# EAGLE design mosquino-pwr-peltier (EAGLE 5.08)
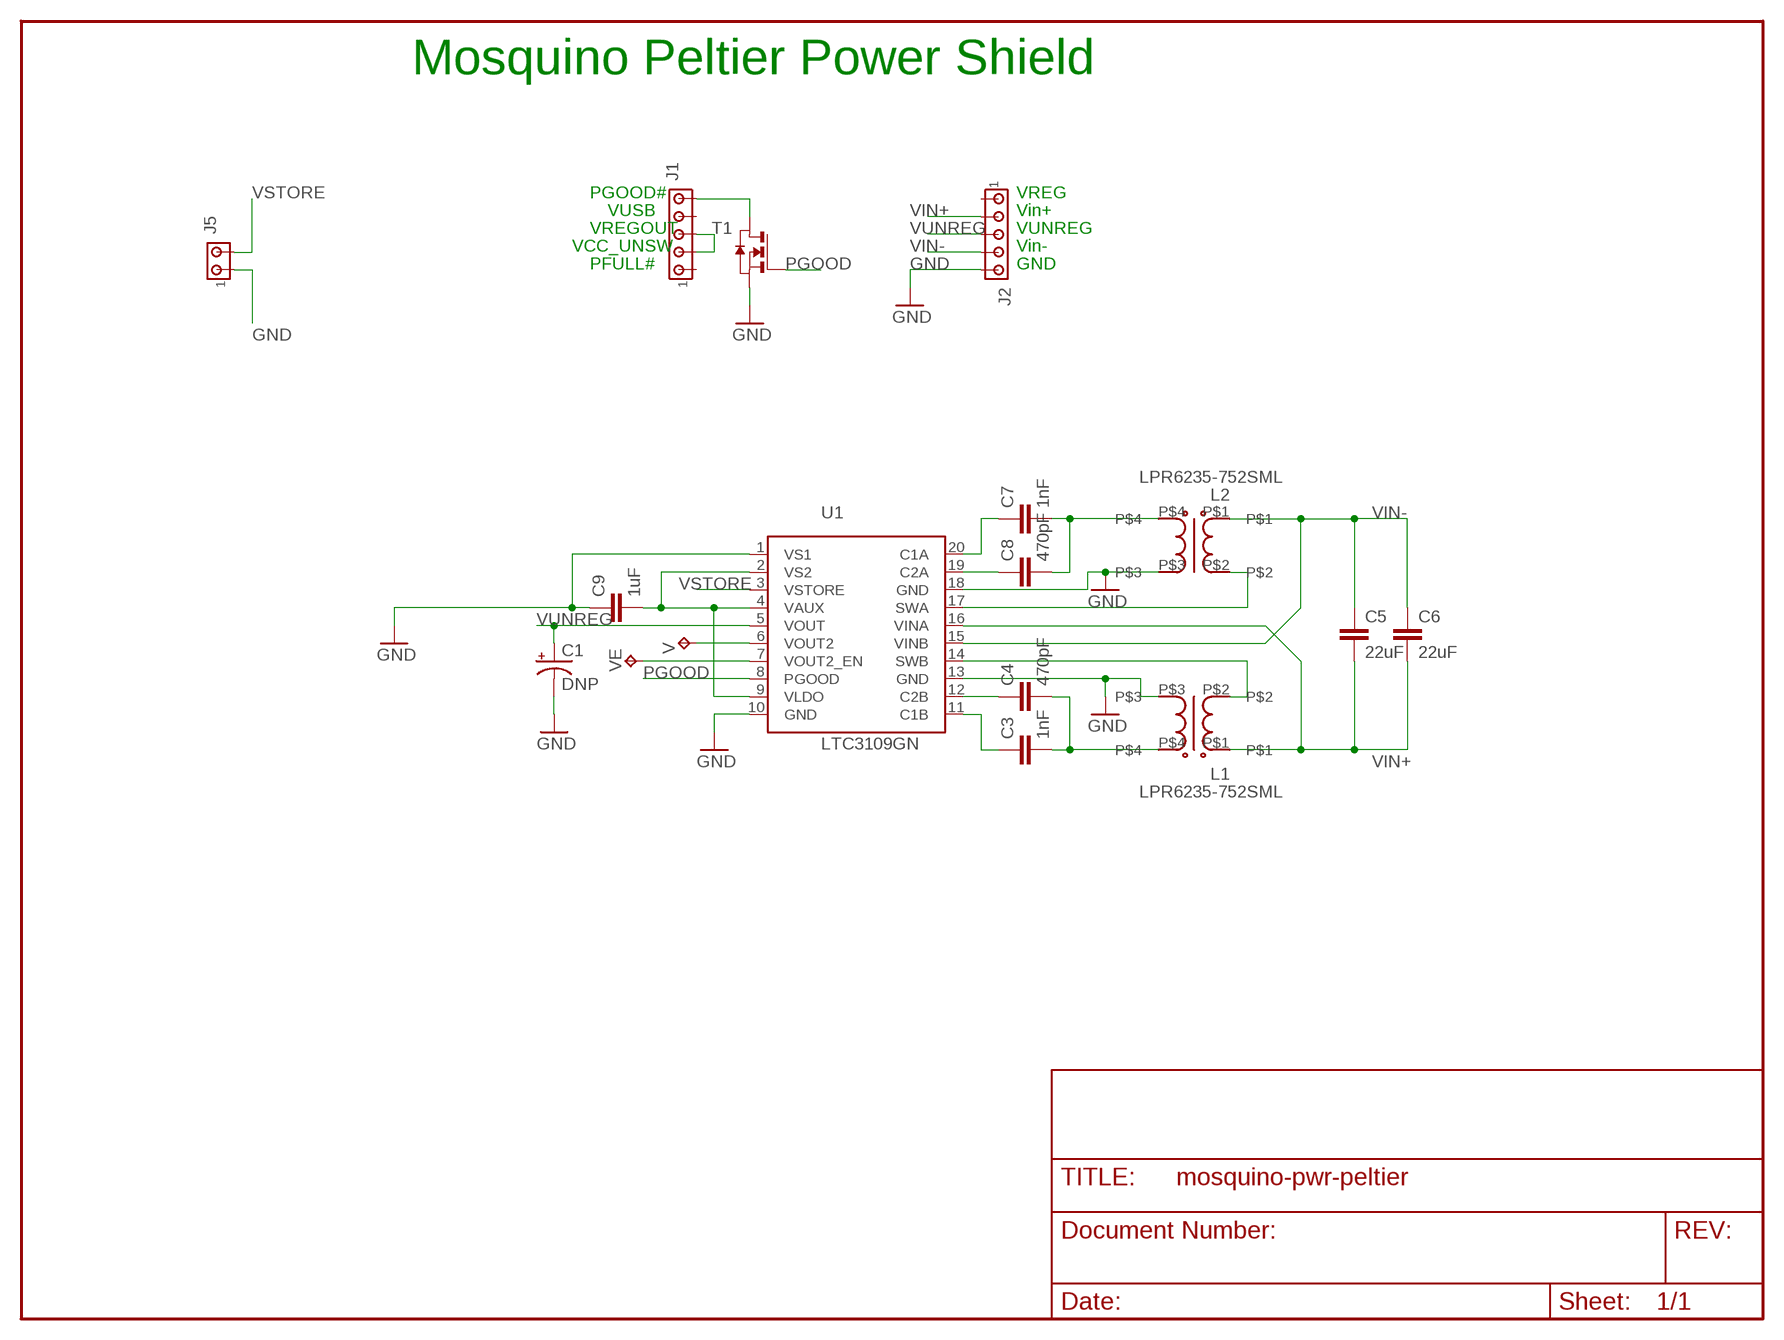
[diagram p0: schematic, sheet 1]

## Parts
C1  DNP  CPOL-USD  [PANASONIC_D]
C3  1nF  C-EUC0603  [C0603]
C4  470pF  C-EUC0603  [C0603]
C5  22uF  C-EUC0805  [C0805]
C6  22uF  C-EUC0805  [C0805]
C7  1nF  C-EUC0603  [C0603]
C8  470pF  C-EUC0603  [C0603]
C9  1uF  C-EUC0603  [C0603]
J1  MTA05-100  [10X05MTA]
J2  MTA05-100  [10X05MTA]
J5  MTA02-100  [10X02MTA]
L1  LPR6235-752SML  LPR6235_COIL  [LPR6235_COIL]
L2  LPR6235-752SML  LPR6235_COIL  [LPR6235_COIL]
T1  NMOSSOT23  [SOT-23]
U1  LTC3109GN  [SSOP20N]
V  TPTP09R  [TP09R]
VE  TPTP09R  [TP09R]

## Nets
GND [pwr]: C1.- C9.1 J2.5 J5.1 L1.P$3 L2.P$3 T1.2(S) U1.1(VS1) U1.10(GND) U1.13(GND) U1.18(GND)
N$1: U1.6(VOUT2) V.TP
N$2: U1.7(VOUT2_EN) VE.TP
N$3: C4.1 U1.12(C2B)
N$4: C3.1 U1.11(C1B)
N$5: C3.2 C4.2 L1.P$4
N$6: J1.5 T1.1(D)
N$7: C7.1 U1.20(C1A)
N$8: C8.1 U1.19(C2A)
N$9: C7.2 C8.2 L2.P$4
N$10: C9.2 U1.2(VS2) U1.4(VAUX) U1.9(VLDO)
N$16: J1.2 J1.3
PGOOD: T1.3(G) U1.8(PGOOD)
SWA: L2.P$2 U1.17(SWA)
SWB: L1.P$2 U1.14(SWB)
VIN+: C5.2 C6.2 J2.2 L1.P$1 U1.16(VINA)
VIN-: C5.1 C6.1 J2.4 L2.P$1 U1.15(VINB)
VSTORE [pwr]: J5.2 U1.3(VSTORE)
VUNREG: C1.+ J2.3 U1.5(VOUT)
Unconnected: J1.1 J1.4 J2.1

## Notes on the sheet
- Mosquino Peltier Power Shield
- PGOOD# | VREG
- VUSB | Vin+
- VREGOUT | VUNREG
- VCC_UNSW | Vin-
- PFULL# | GND

## Library data of the parts
C1 = rcl:CPOL-US: POLARIZED CAPACITOR, American symbol
C3-C9 = rcl:C-EU: CAPACITOR, European symbol
J1 J2 = con-amp:MTA05-100: AMP connector
J5 = con-amp:MTA02-100: AMP connector
L1 L2 = tim:LPR6235_COIL: Coilcraft LPR6235 SMD inductor/transformer. 20100815 / tgipson
T1 = zetex:NMOSSOT23: MOS FET
U1 = tim:LTC3109
V VE = testpad:TP

## Net classes
1 pwr: width 0.305 mm, drill 0.508 mm, clearance 0.203 mm
4 digital: width 0.203 mm, drill 0.381 mm, clearance 0.203 mm

## Board
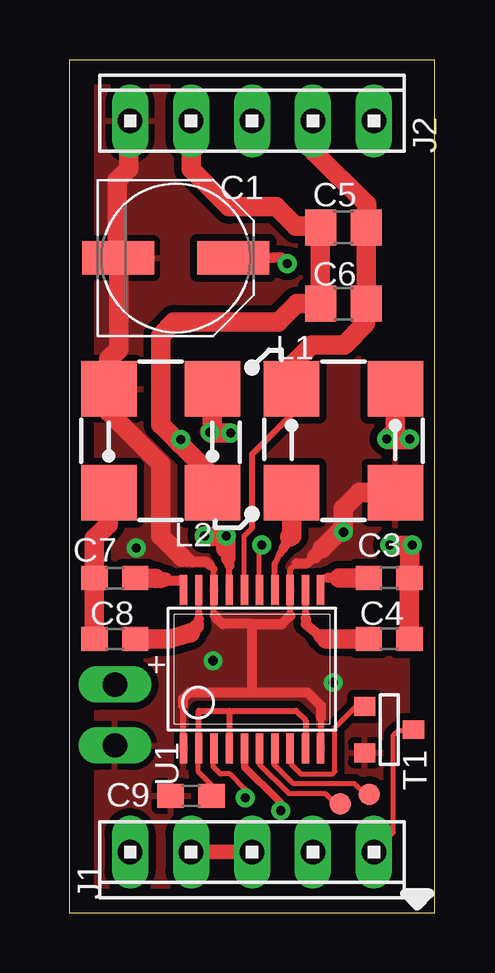
[diagram p1: board, top side]
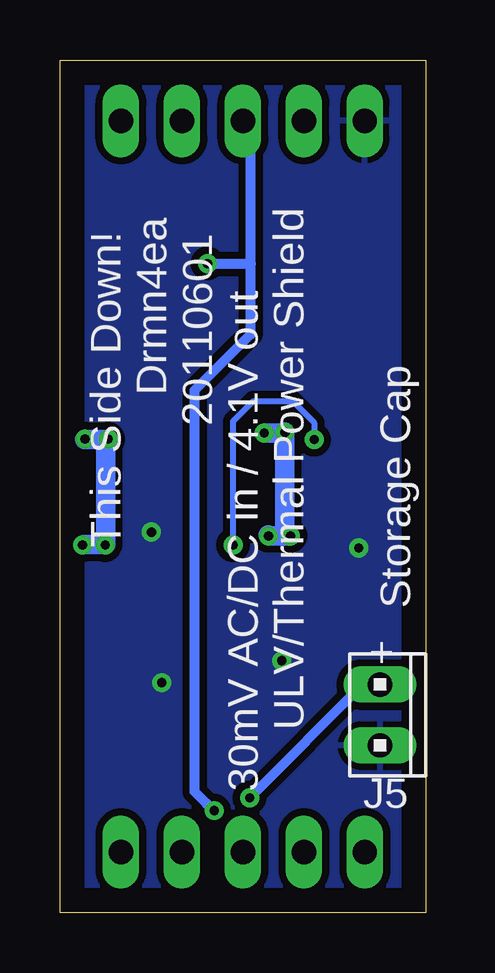
[diagram p2: board, bottom side, seen from below]

Size 15.24 x 35.56 mm. Coordinates in mm from the lower left corner, seen from the top.
Outline: 15.24,35.56 0,35.56 0,0 15.24,0 15.24,35.56
Copper layers (1*16): Top 0.035mm / dielectric 1.5mm / Bottom 0.035mm
Design rules "default": minimum track width 8mil, minimum drill 15mil, track to track 8mil, track to pad 8mil, pad to pad 8mil, via to via 8mil, smd to smd 8mil, copper to edge 40mil, drill to drill 8mil, minimum pad ring 10mil, minimum via ring 8mil, stop-mask expansion 4mil, vias tented up to drill 0mil, thermal gap 10mil

### Footprints (pad centres in the part's own frame; a part is rotated, then mirrored left to right if it is on the bottom)
PANASONIC_D = smd 3 x 1.4: + 2.4,0; - -2.4,0
C0603 = smd 1.1 x 1: 1 -0.85,0; 2 0.85,0
C0805 = smd 1.3 x 1.5: 1 -0.95,0; 2 0.95,0
10X05MTA = drill 1.016 long: 1 5.08,0; 2 2.54,0; 3 0,0; 4 -2.54,0; 5 -5.08,0
10X02MTA = drill 1.016 long: 1 1.27,0; 2 -1.27,0
LPR6235_COIL = smd 2.311 x 2.311: P$1 -2.159,2.159; P$2 -2.159,-2.159; P$3 2.159,-2.159; P$4 2.159,2.159
SOT-23 = smd 0.787 x 0.889: 1 0.025,-1.016; 2 -0.94,1.016; 3 0.991,1.016
SSOP20N = smd 0.305 x 1.245: 1 -2.857,-3.302; 2 -2.223,-3.302; 3 -1.587,-3.302; 4 -0.953,-3.302; 5 -0.318,-3.302; 6 0.318,-3.302; 7 0.953,-3.302; 8 1.587,-3.302; 9 2.223,-3.302; 10 2.857,-3.302; 11 2.857,3.302; 12 2.223,3.302; 13 1.587,3.302; 14 0.953,3.302; 15 0.318,3.302; 16 -0.318,3.302; 17 -0.953,3.302; 18 -1.587,3.302; 19 -2.223,3.302; 20 -2.857,3.302
TP09R = smd 0.9 x 0.9: TP 0,0

### Placement (x,y rotation side)
C1  4.45,27.3 0 top
C3  13.34,13.97 0 top
C4  13.34,11.43 0 top
C5  11.43,28.57 0 top
C6  11.43,25.4 0 top
C7  1.91,13.97 180 top
C8  1.91,11.43 180 top
C9  5.08,4.88 0 top
J1  7.62,2.54 180 top
J2  7.62,33.02 0 top
J5  1.91,8.26 270 bottom
L1  11.43,19.68 0 top
L2  3.81,19.68 180 top
T1  13.34,7.62 90 top
U1  7.62,10.16 0 top
V  11.3,4.55 180 top
VE  12.5,4.95 180 top

### Tracks (layer width: path | path; a pad name or v marks a point on that pad's centre or on a via)
GND  (via drill 0.38)
  Top 0.254: U1.1 4.78,6.87 | U1.1 4.75,6.84 | 6.02,14.35 6.02,13.54 6.03,13.53 U1.18 6.02,12.45 6.07,12.39 | 9.47,14.58 9.22,14.33 9.22,13.47 U1.13 9.22,12.39 | U1.1 4.75,6.87 4.75,8.66 | U1.10 10.49,6.87 10.49,8.15
  Top 0.305: 6.02,14.35 5.87,14.5 | 7.62,11.89 7.62,12.04
  Top 0.406: 4.93,14.73 5.08,14.73 5.13,14.63 5.74,14.63 5.87,14.5 | 10.21,14.86 9.93,14.58 9.47,14.58 | 4.75,8.66 4.75,8.94 5,9.2 7.62,9.2 | 10.49,8.15 10.49,8.64 9.93,9.2 7.62,9.2 | 9.22,12.39 8.87,12.04 7.62,12.04 6.4,12.04 6.07,12.37 6.07,12.39 | 7.62,9.2 7.62,11.89 7.62,11.94
  Top 0.61: 4.7,14.83 4.83,14.83 4.93,14.73 | 10.21,14.86 10.54,15.19
  Top 0.813: J2.5 2.49,32.97 2.49,31.04 2.01,30.56 2.01,27.34 C1.- 2.06,27.32 | 2.06,27.32 2.06,27.41 | 2.06,27.32 2.06,23.5 1.65,23.09 L2.P$3 1.65,20.88 3.81,18.72 3.81,15.72 4.7,14.83 | L1.P$3 12.09,17.53 11.43,16.87 11.43,16.08 10.54,15.19
  other vias: 11.43,15.88 11,9.6 5.99,10.52 2.79,15.21
  pour Top (isolate 0.305): 15.24,35.56 15.24,0 0,0 0,35.56
  pour Bottom (isolate 0.305): 15.24,0 0,0 0,35.56 15.24,35.56
N$1
  Top 0.203: U1.6 7.92,6.84 7.92,6.2 9.14,4.98 10.67,4.98 11.1,4.55 V.TP
N$2
  Top 0.203: U1.7 8.53,6.82 8.53,6.2 9.35,5.38 11.89,5.38 12.29,4.98 VE.TP
N$3
  Top 0.254: 9.86,13.47 9.86,13.54 | 9.86,13.47 U1.12 | 9.86,12.52 9.86,13.47
  Top 0.305: 9.86,12.52 9.86,12.29
  Top 0.406: 10.49,11.53 9.86,12.04 9.86,12.29
  Top 0.61: 10.72,11.43 10.62,11.53 10.49,11.53
  Top 0.813: 10.72,11.43 C4.1
N$4
  Top 0.203: 10.77,13.97 10.52,13.97 10.46,13.92 10.46,13.45 | 10.46,13.45 10.46,13.41 | 10.46,13.45 U1.11
  Top 0.406: 11.25,13.97 10.77,13.97
  Top 0.813: C3.1 11.25,13.97
N$5  (via drill 0.38)
  Top 0.203: v14.2,19.76 14.12,19.71 14.12,19.74 | 13.72,19.74 13.72,19.71 13.59,19.86
  Top 0.813: v13.23,19.76 13.34,19.86 13.59,19.86 L1.P$4 | 14.28,15.32 14.2,15.24 14.2,13.98 C3.2 14.17,13.96 14.17,11.44 C4.2 | 13.28,19.74 13.72,19.74 14.12,19.74 14.2,19.74 | 14.28,15.32 v14.3,15.34 | v13.36,15.34 13.39,15.32 14.28,15.32
  Bottom 0.203: v13.23,19.76 13.21,19.71 13.23,19.74
  Bottom 0.813: v13.23,19.76 13.26,19.74 13.34,19.74 13.34,15.37 | v13.36,15.34 13.34,15.37 | 13.34,15.37 14.22,15.37 | 13.23,19.74 14.2,19.74
N$6
  Top 0.203: T1.1 14.33,7.62 13.72,7.62 13.51,7.42 13.51,3.35 J1.5
N$7
  Top 0.254: 4.7,13.84 4.75,13.58 U1.20
  Top 0.406: 4.01,13.89 4.22,13.84 4.7,13.84
  Top 0.61: 3.61,13.95 3.81,13.84 4.01,13.89
  Top 0.813: 3.61,13.95 C7.1
N$8
  Top 0.254: U1.19 5.41,12.52
  Top 0.305: 5.41,12.24 5.41,12.52
  Top 0.406: 5.31,11.94 5.41,12.04 5.41,12.24
  Top 0.61: 5.05,11.68 5.31,11.94
  Top 0.813: C8.1 4.17,11.43 5.05,11.68
N$9
  Top 0.813: L2.P$4 1.63,17.5 1.63,16.2 1.04,15.62 1.04,13.32 | C8.2 1.04,11.44 1.04,13.32 | 1.04,13.32 C7.2
N$10
  Top 0.203: 5.38,6.84 5.38,5.89 5.93,5.35 C9.2
  Top 0.254: 6.68,8.43 9.45,8.43 9.86,8.03 9.86,6.87 U1.9 | 6.68,8.43 5.41,8.43 5.41,6.87 U1.2 5.38,6.84 | U1.4 6.68,6.87 6.68,8.43
N$16
  Top 0.61: J1.2 J1.3
PGOOD
  Top 0.203: U1.8 9.25,6.86 9.25,6.2 9.65,5.79 10.97,5.79 11.07,5.89 11.07,7.72 11.96,8.61 T1.3
SWA  (via drill 0.38)
  Top 0.254: U1.17 6.68,13.47 6.68,14.48
  Top 0.406: 6.63,14.78 6.68,14.73 6.68,14.48
  Top 0.61: 6.53,15.19 6.63,15.09 6.63,14.78
  Top 0.813: L2.P$2 5.97,20.14 v5.87,20.04 5.89,20.02 v6.73,20.02 | v5.64,15.72 5.66,15.7 6.53,15.7 | 6.53,15.7 v6.55,15.72 | 6.53,15.19 6.53,15.7
  Bottom 0.813: 5.69,15.72 5.87,15.72 5.87,20.02 | v5.64,15.72 5.69,15.72 | 5.87,20.02 v5.87,20.04 | 6.55,15.75 6.53,15.72 5.69,15.72 | 5.87,20.02 v6.73,20.02
SWB
  Top 0.254: 8.79,14.99 8.71,14.86 8.56,14.55 8.56,13.47 U1.14
  Top 0.305: 8.79,14.99 8.94,15.21
  Top 0.406: 9.2,15.67 9.07,15.42 8.99,15.32 8.94,15.21
  Top 0.813: L1.P$2 9.27,15.72 9.2,15.67
VIN+
  Top 0.203: U1.16 7.29,13.47 7.29,15.72 7.62,16.05
  Top 0.254: 7.62,16.05 7.62,19.13 9.27,20.78 L1.P$1
  Top 0.813: L1.P$1 9.27,22.84 10.11,23.67 11.46,23.67 12.34,24.56 12.34,25.36 C6.2 C5.2 12.39,28.59 12.39,29.54 10.21,31.73 10.21,33.07 J2.2
VIN-  (via drill 0.38)
  Top 0.203: U1.15 7.92,13.47 7.92,15.34 v8.03,15.34
  Top 0.813: J2.4 5.08,31.01 6.66,29.44 8.64,29.44 9.45,28.63 10.43,28.63 C5.1 10.46,28.56 10.46,25.41 C6.1 9.47,25.4 8.71,24.64 4.37,24.64 3.81,24.08 3.81,20.37 4.6,19.58 v4.65,19.74 4.65,19.53 6.02,18.16 6.02,17.58 L2.P$1
  Bottom 0.254: v8.03,15.34 8.03,20.5 7.19,21.34 5.54,21.34 4.65,20.45 v4.65,19.74
VSTORE  (via drill 0.38)
  Top 0.203: 6.02,6.84 5.99,6.82 5.99,6.1 6.3,5.79 6.71,5.79 7.34,5.16 v7.34,4.8
  Top 0.254: 6.02,6.84 U1.3
  Bottom 0.406: J5.2 2.62,9.53 v7.34,4.8
VUNREG  (via drill 0.38)
  Top 0.254: U1.5 7.29,6.84
  Top 0.305: U1.5 7.32,6.84 7.32,6.07 8.64,4.78 8.81,4.6 v8.81,4.27
  Top 0.406: C1.+ 8.51,27.3 8.53,27.33 8.84,27.33 v9.09,27.08
  Bottom 0.203: v9.09,27.08 9.04,27.03 9.04,27.05
  Bottom 0.406: J2.3 7.29,32.69 7.29,27.05 | 7.29,27.05 9.04,27.05 9.09,27.05 | 7.29,27.05 7.29,24.13 9.63,21.79 9.63,5.05 9.14,4.57 v8.81,4.27

### Text on the board
tPlace: +
bNames: Drmn4ea | 20110601 | This Side Down! | Storage Cap | + | ULV/Thermal Power Shield | 30mV AC/DC in / 4.1V out